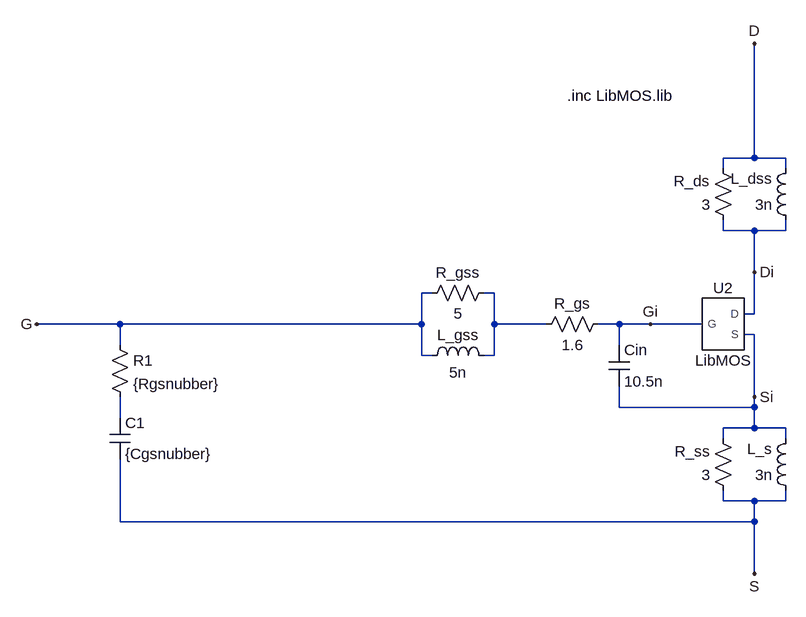
[diagram p0: schematic MyMOS.asc]
MyMOS.asc, the LTspice schematic file:
Version 4
SHEET 1 880 680
WIRE 160 -128 160 -304
WIRE 160 -128 112 -128
WIRE 208 -128 160 -128
WIRE 112 -112 112 -128
WIRE 208 -112 208 -128
WIRE 112 -16 112 -32
WIRE 160 -16 112 -16
WIRE 208 -16 208 -32
WIRE 208 -16 160 -16
WIRE 160 48 160 -16
WIRE -336 80 -352 80
WIRE -240 80 -256 80
WIRE 160 112 160 48
WIRE 160 112 144 112
WIRE -816 128 -944 128
WIRE -352 128 -352 80
WIRE -352 128 -816 128
WIRE -240 128 -240 80
WIRE -160 128 -240 128
WIRE -48 128 -80 128
WIRE 0 128 -48 128
WIRE 80 128 0 128
WIRE 160 144 144 144
WIRE -816 160 -816 128
WIRE -48 160 -48 128
WIRE -352 176 -352 128
WIRE -336 176 -352 176
WIRE -240 176 -240 128
WIRE -240 176 -256 176
WIRE 160 240 160 144
WIRE -48 256 -48 224
WIRE 160 256 160 240
WIRE 160 256 -48 256
WIRE -816 272 -816 240
WIRE 160 288 160 256
WIRE 160 288 112 288
WIRE 208 288 160 288
WIRE 112 304 112 288
WIRE 208 304 208 288
WIRE 112 400 112 384
WIRE 160 400 112 400
WIRE 208 400 208 384
WIRE 208 400 160 400
WIRE -816 432 -816 336
WIRE 160 432 160 400
WIRE 160 432 -816 432
WIRE 160 512 160 432
FLAG -944 128 G
FLAG 160 -304 D
FLAG 160 512 S
FLAG 160 48 Di
FLAG 160 240 Si
FLAG 0 128 Gi
SYMBOL res -240 64 R90
WINDOW 0 0 56 VBottom 2
WINDOW 3 32 56 VTop 2
SYMATTR InstName R_gss
SYMATTR Value 5
SYMBOL res 128 -16 R180
WINDOW 0 36 76 Left 2
WINDOW 3 36 40 Left 2
SYMATTR InstName R_ds
SYMATTR Value 3
SYMBOL res 128 400 R180
WINDOW 0 36 76 Left 2
WINDOW 3 36 40 Left 2
SYMATTR InstName R_ss
SYMATTR Value 3
SYMBOL ind -352 192 R270
WINDOW 0 32 56 VTop 2
WINDOW 3 5 56 VBottom 2
SYMATTR InstName L_gss
SYMATTR Value 5n
SYMBOL ind 224 -16 R180
WINDOW 0 36 80 Left 2
WINDOW 3 36 40 Left 2
SYMATTR InstName L_dss
SYMATTR Value 3n
SYMBOL ind 224 400 R180
WINDOW 0 36 80 Left 2
WINDOW 3 36 40 Left 2
SYMATTR InstName L_s
SYMATTR Value 3n
SYMBOL res -64 112 R90
WINDOW 0 0 56 VBottom 2
WINDOW 3 32 56 VTop 2
SYMATTR InstName R_gs
SYMATTR Value 1.6
SYMBOL cap -64 160 R0
SYMATTR InstName Cin
SYMATTR Value 10.5n
SYMBOL LibMOS 112 128 R0
SYMATTR InstName U2
SYMATTR Value LibMOS
SYMBOL cap -832 272 R0
SYMATTR InstName C1
SYMATTR Value {Cgsnubber}
SYMBOL res -832 144 R0
SYMATTR InstName R1
SYMATTR Value {Rgsnubber}
TEXT -128 -224 Left 2 !.inc LibMOS.lib

The netlist it stands for:
* MyMOS.asc
R_gss N001 G 5
R_ds Di D 3
R_ss S Si 3
L_gss G N001 5n
L_dss Di D 3n
L_s S Si 3n
R_gs Gi N001 1.6
Cin Gi Si 10.5n
XU2 Gi Di Si LibMOS  ; pins G D S
C1 N002 S {Cgsnubber}
R1 G N002 {Rgsnubber}
.inc LibMOS.lib
.lib LibMOS.lib
.backanno
.end